# EAGLE schematic esp_ftdi_breakout (EAGLE 8.4.0)
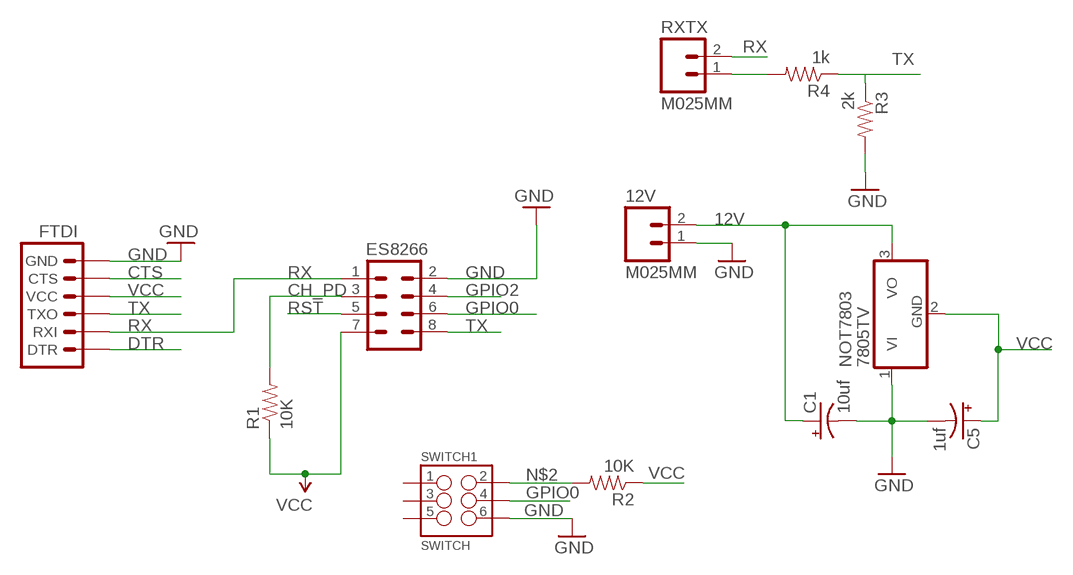
[diagram p0: schematic, sheet 1]

## Parts
12V  M025MM  [SCREWTERMINAL-5MM-2]
C1  10uf  CAP_POLPTH2  [CPOL-RADIAL-10UF-25V]
C5  1uf  CAP_POLPTH2  [CPOL-RADIAL-10UF-25V]
ES8266  M04X2  [2X4]
FTDI  ARDUINO_SERIAL_PROGRAMPTH  [1X06]
NOT7803  7805TV  [TO220V]
R1  10K  1KOHM-1/4W-1%(PTH)  [AXIAL-0.3]
R2  10K  1KOHM-1/4W-1%(PTH)  [AXIAL-0.3]
R3  2k  1KOHM-1/4W-1%(PTH)  [AXIAL-0.3]
R4  1k  1KOHM-1/4W-1%(PTH)  [AXIAL-0.3]
RXTX  M025MM  [SCREWTERMINAL-5MM-2]
SWITCH1  SWITCH  M03X2FEMALE  [2X3]

## Nets
12V: 12V.2 C1.1(+) NOT7803.3(VO)
CH_PD: ES8266.3 R1.P$2
CTS: FTDI.5(CTS)
DTR: FTDI.1(DTR)
GND: 12V.1 C1.2(-) C5.2(-) ES8266.2 FTDI.6(GND) NOT7803.1(VI) R3.P$2 SWITCH1.6
GPIO0: ES8266.6 SWITCH1.4
GPIO2: ES8266.4
N$1: R4.P$2 RXTX.1
N$2: R2.P$2 SWITCH1.2
RST: ES8266.5
RX: ES8266.1 FTDI.2(RXI) RXTX.2
TX: ES8266.8 FTDI.3(TXO) R3.P$1 R4.P$1
VCC: C5.1(+) ES8266.7 FTDI.4(VCC) NOT7803.2(GND) R1.P$1 R2.P$1
Unconnected: SWITCH1.1 SWITCH1.3 SWITCH1.5

## Library data of the parts
12V RXTX = SparkFun-Connectors:M02: Standard 2-pin 0.1" header. Use with - straight break away headers ( PRT-00116) - right angle break away headers (PRT-00553) - swiss pins (PRT-00743) - machine pins (PRT-00117) - female headers (PRT-00115) Molex polarized connector foot print use with: PRT-08233 with associated crimp pins and housings. 2.54_SCREWTERM for use with PRT-10571. 3.5mm Screw Terminal footprints for PRT-08084 5mm Screw Terminal footprints for use with PRT-08433
C1 C5 = SparkFun-Capacitors:CAP_POL: Capacitor Polarized These are standard SMD and PTH capacitors. Normally 10uF, 47uF, and 100uF in electrolytic and tantalum varieties. Always verify the external diameter of the through hole cap, it varies with capacity, voltage, and manufacturer. The EIA devices should be standard.
ES8266 = SparkFun-Connectors:M04X2: .1" header, two rows of four.
FTDI = SparkFun-Connectors:ARDUINO_SERIAL_PROGRAM: FTDI connector footprints
NOT7803 = linear:78*: Positive VOLTAGE REGULATOR Source: http://cache.national.com/ds/LM/LM78L05.pdf http://www.fairchildsemi.com/ds/LM/LM7805.pdf; SPICEPREFIX: J
R1-R4 = SparkFun-Resistors:1KOHM-1/4W-1%(PTH): RES-12182; PROD_ID: RES-12182; VALUE: 1K
SWITCH1 = SparkFun-Connectors:M03X2: 2x3 .1" header. Shrouded, with keying- CONN-10681 SMT- CONN-11415 Pogo pins- HW-11044; PROD_ID: CONN-11566; VALUE: FEMALE 2x3